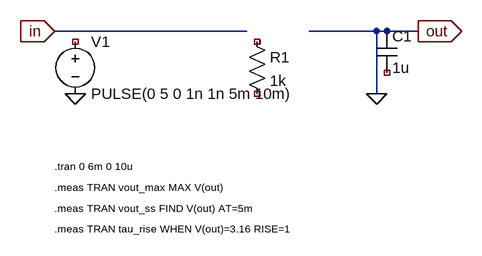
[diagram p0: schematic rc_step.asc]
rc_step.asc, the LTspice schematic file:
Version 4
SHEET 1 1200 800
WIRE 64 192 360 192
WIRE 456 192 624 192
WIRE 560 192 560 288
SYMBOL voltage 96 192 R0
SYMATTR InstName V1
SYMATTR Value PULSE(0 5 0 1n 1n 5m 10m)
SYMBOL res 360 192 R0
SYMATTR InstName R1
SYMATTR Value 1k
SYMBOL cap 560 192 R0
SYMATTR InstName C1
SYMATTR Value 1u
FLAG 64 192 in
IOPIN 64 192 In
FLAG 624 192 out
IOPIN 624 192 Out
FLAG 96 288 0
FLAG 560 288 0
TEXT 64 400 Left 1 !.tran 0 6m 0 10u
TEXT 64 432 Left 1 !.meas TRAN vout_max MAX V(out)
TEXT 64 464 Left 1 !.meas TRAN vout_ss FIND V(out) AT=5m
TEXT 64 496 Left 1 !.meas TRAN tau_rise WHEN V(out)=3.16 RISE=1

The netlist it stands for:
* rc_step.asc
V1 NC_01 0 PULSE(0 5 0 1n 1n 5m 10m)
R1 NC_02 NC_03 1k
C1 0 NC_04 1u
.tran 0 6m 0 10u
.meas TRAN vout_max MAX V(out)
.meas TRAN vout_ss FIND V(out) AT=5m
.meas TRAN tau_rise WHEN V(out)=3.16 RISE=1
.backanno
.end